# EAGLE design capstone (EAGLE 9.4.0)
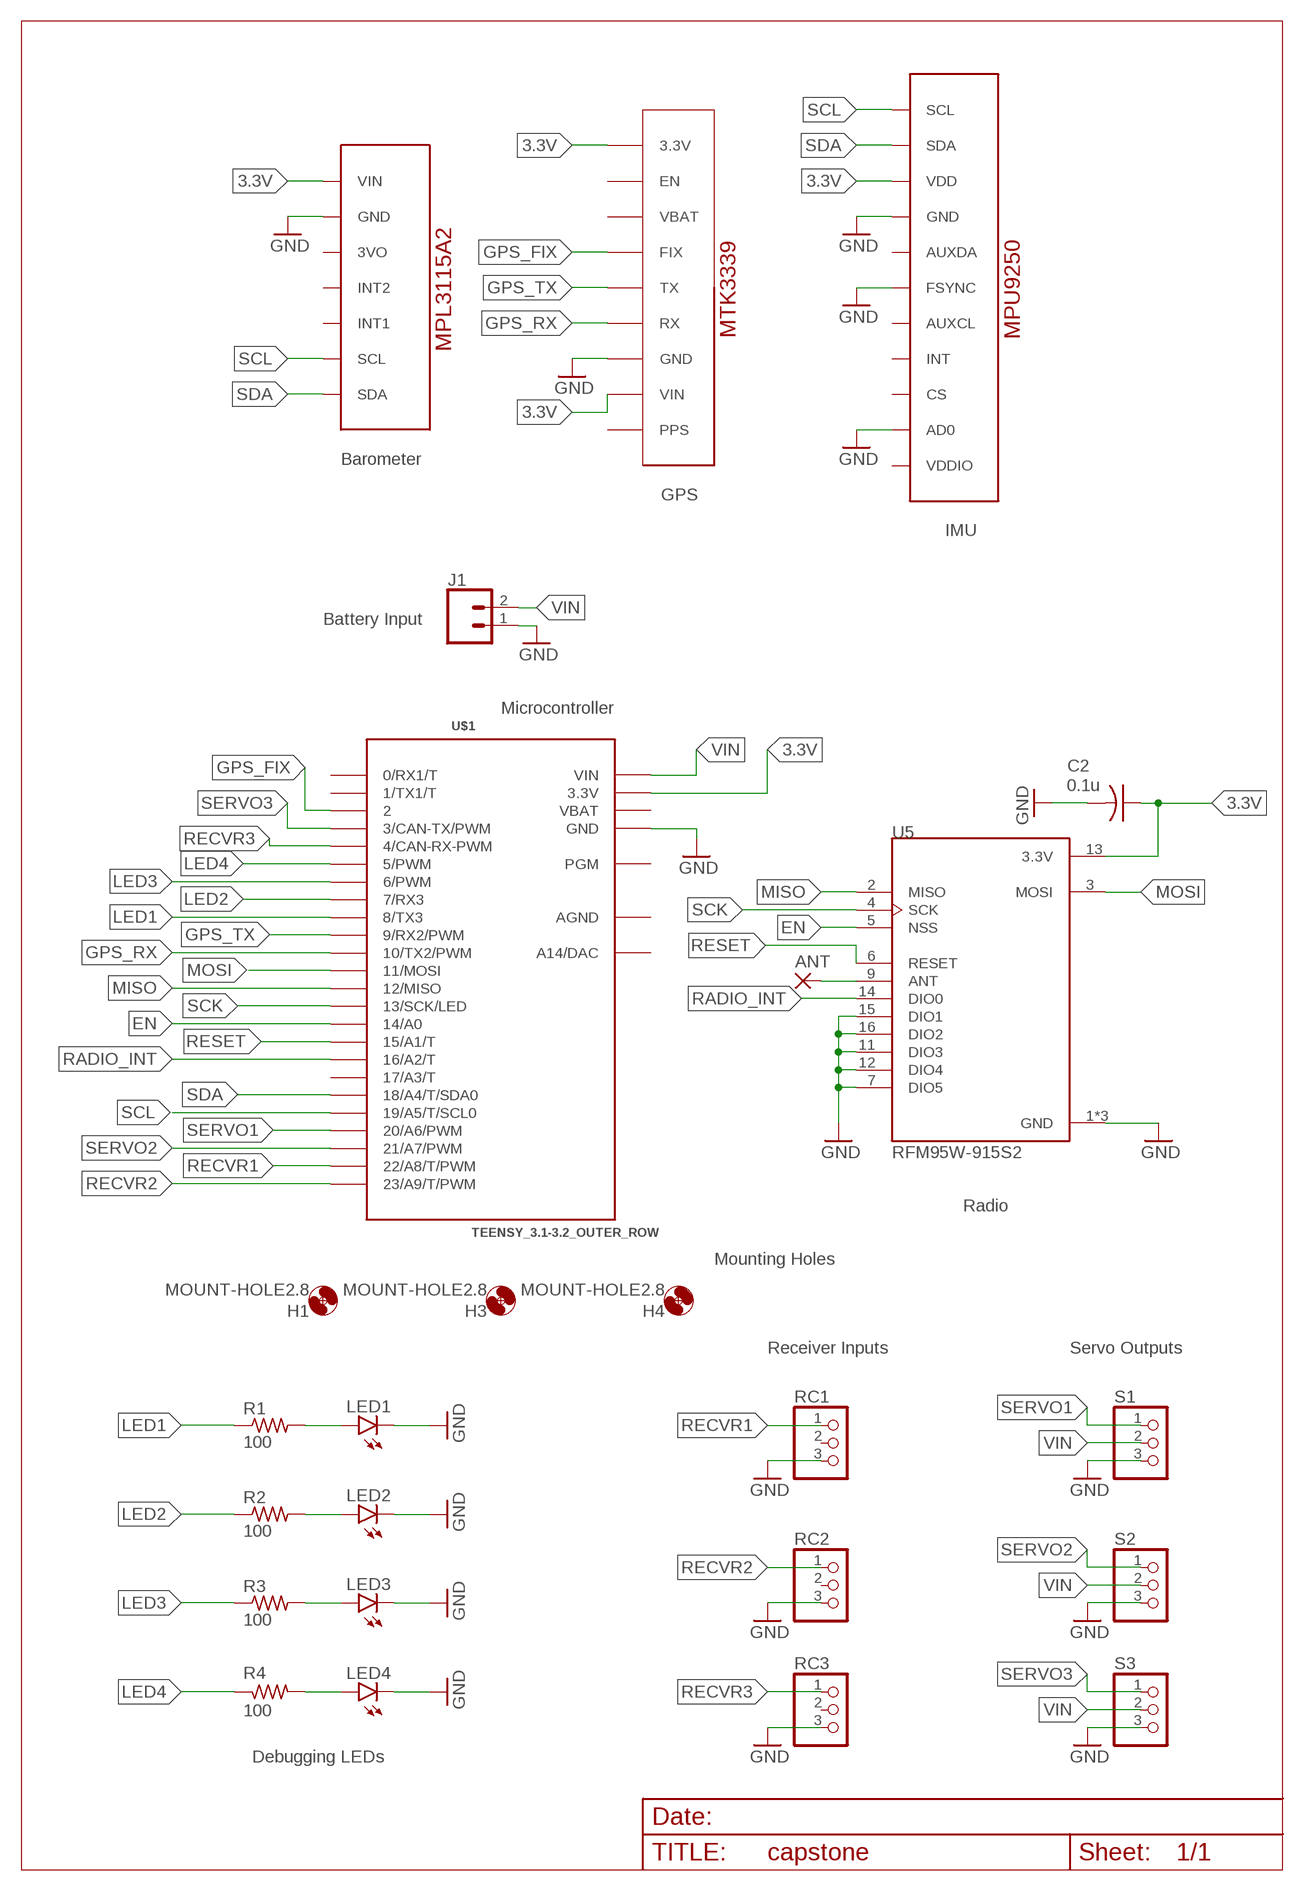
[diagram p0: schematic, sheet 1]

## Parts
ANT  2,54/0,9  [2,54/0,9]
C2  0.1u  C-USC1206  [C1206]
H1  MOUNT-HOLE2.8  [2,8]
H3  MOUNT-HOLE2.8  [2,8]
H4  MOUNT-HOLE2.8  [2,8]
J1  CONN_025MM  [SCREWTERMINAL-5MM-2]
LED1  LEDCHIPLED_1206  [CHIPLED_1206]
LED2  LEDCHIPLED_1206  [CHIPLED_1206]
LED3  LEDCHIPLED_1206  [CHIPLED_1206]
LED4  LEDCHIPLED_1206  [CHIPLED_1206]
R1  100  R-US_M1206  [M1206]
R2  100  R-US_M1206  [M1206]
R3  100  R-US_M1206  [M1206]
R4  100  R-US_M1206  [M1206]
RC1  PINHD-1X3  [1X03]
RC2  PINHD-1X3  [1X03]
RC3  PINHD-1X3  [1X03]
S1  PINHD-1X3  [1X03]
S2  PINHD-1X3  [1X03]
S3  PINHD-1X3  [1X03]
U1  ADAFRUIT_MPL3115A2_BAROMETER  [ADAFRUIT_MPL3115A2_BAROMETER]
U2  ADAFRUIT_MTK3339_GPS  [ADAFRUIT_MTK3339_GPS]
U4  SPARKFUN_MPU9250_IMU  [SPARKFUN_MPU9250_IMU]
U5  RFM95W-915S2  [XCVR_RFM95W-915S2]
U$1  TEENSY_3.1-3.2_OUTER_ROW  [TEENSY_3.0-3.2&LC_OUTER_ROW]

## Nets
3.3V: C2.1 U1.VIN U2.3.3V U2.VIN U4.VDD U5.13(3.3V) U$1.3.3V U$1.3.3V1(3.3V)
EN: U5.5(NSS) U$1.14/A0
GND: C2.2 J1.1 LED1.C LED2.C LED3.C LED4.C RC1.3 RC2.3 RC3.3 S1.3 S2.3 S3.3 U1.GND U2.GND U4.AD0 U4.FSYNC U4.GND U5.1(GND) U5.7(DIO5) U5.8(GND) U5.10(GND) U5.11(DIO3) U5.12(DIO4) U5.15(DIO1) U5.16(DIO2) U$1.GND U$1.GND1(GND)
GPS_FIX: U2.FIX U$1.2
GPS_RX: U2.RX U$1.10(10/TX2/PWM)
GPS_TX: U2.TX U$1.9(9/RX2/PWM)
LED1: R1.1 U$1.8(8/TX3)
LED2: R2.1 U$1.7(7/RX3)
LED3: R3.1 U$1.6(6/PWM)
LED4: R4.1 U$1.5(5/PWM)
MISO: U5.2(MISO) U$1.12(12/MISO)
MOSI: U5.3(MOSI) U$1.11(11/MOSI)
N$1: ANT.1(P) U5.9(ANT)
N$8: LED1.A R1.2
N$9: LED2.A R2.2
N$10: LED3.A R3.2
N$11: LED4.A R4.2
RADIO_INT: U5.14(DIO0) U$1.16/A2(16/A2/T)
RECVR1: RC1.1 U$1.22/A8(22/A8/T/PWM)
RECVR2: RC2.1 U$1.23/A9(23/A9/T/PWM)
RECVR3: RC3.1 U$1.4(4/CAN-RX-PWM)
RESET: U5.6(RESET) U$1.15/A1(15/A1/T)
SCK: U5.4(SCK) U$1.13(13/SCK/LED)
SCL: U1.SCL U4.SCL U$1.19/A5(19/A5/T/SCL0)
SDA: U1.SDA U4.SDA U$1.18/A4(18/A4/T/SDA0)
SERVO1: S1.1 U$1.20/A6(20/A6/PWM)
SERVO2: S2.1 U$1.21/A7(21/A7/PWM)
SERVO3: S3.1 U$1.3(3/CAN-TX/PWM)
VIN: J1.2 S1.2 S2.2 S3.2 U$1.VIN
Unconnected: RC1.2 RC2.2 RC3.2 U1.3VO U1.INT1 U1.INT2 U2.EN U2.PPS U2.VBAT U4.AUXCL U4.AUXDA U4.CS U4.INT U4.VDDIO U$1.0(0/RX1/T) U$1.1(1/TX1/T) U$1.17/A3(17/A3/T) U$1.PGM U$1.RESET/DAC(A14/DAC)

## Notes on the sheet
- Barometer
- GPS
- IMU
- Battery Input
- Microcontroller
- Radio
- Mounting Holes
- Receiver Inputs | Servo Outputs
- Debugging LEDs

## Power pins joined to a net without a drawn wire
AGND: U$1.AGND
VBAT: U$1.VBAT

## Library data of the parts
ANT = wirepad:2,54/0,9: THROUGH-HOLE PAD
C2 = rcl:C-US: CAPACITOR, American symbol; SPICEPREFIX: C
H1 H3 H4 = holes:MOUNT-HOLE: MOUNTING HOLE with drill center marker
J1 = SparkFun-Connectors:CONN_02: Multi connection point. Often used as Generic Header-pin footprint for 0.1 inch spaced/style header connections On any of the 0.1 inch spaced packages, you can populate with these: Break Away Headers - Straight <https://www.sparkfun.com/products/116> (PRT-00116) Break Away Male Headers - Right Angle <https://www.sparkfun.com/products/553> (PRT-00553) Female Headers <https://www.sparkfun.com/products/115> (PRT-00115) Break Away Headers - Machine Pin <https://www.sparkfun.com/products/117> (PRT-00117) Break Away Female Headers - Swiss Machine Pin <https://www.sparkfun.com/products/743> (PRT-00743) For SCREWTERMINALS and SPRING TERMINALS visit here: Screw Terimnals on SparkFun.com <https://www.sparkfun.com/search/results?term=Screw+Terminals> (5mm/3.5mm/2.54mm spacing) This device is also useful as a general connection point to wire up your design to another part of your project. Our various solder wires solder well into these plated through hole pads. Hook-Up Wire - Assortment (Stranded, 22 AWG) <https://www.sparkfun.com/products/11375> (PRT-11375) Hook-Up Wire - Assortment (Solid Core, 22 AWG) <https://www.sparkfun.com/products/11367> (PRT-11367) View the entire wire category on our website here <https://www.sparkfun.com/categories/141> Special notes: Molex polarized connector foot print use with: PRT-08233 with associated crimp pins and housings. 2.54_SCREWTERM for use with PRT-10571. 3.5mm Screw Terminal footprints for PRT-08084 5mm Screw Terminal footprints for use with PRT-08432; SF_SKU: PRT-08432
LED1-LED4 = led:LED: LED OSRAM: - CHIPLED LG R971, LG N971, LY N971, LG Q971, LY Q971, LO R971, LY R971 LH N974, LH R974 LS Q976, LO Q976, LY Q976 LO Q996 - Hyper CHIPLED LW Q18S LB Q993, LB Q99A, LB R99A - SideLED LS A670, LO A670, LY A670, LG A670, LP A670 LB A673, LV A673, LT A673, LW A673 LH A674 LY A675 LS A676, LA A676, LO A676, LY A676, LW A676 LS A679, LY A679, LG A679 - Hyper Micro SIDELED® LS Y876, LA Y876, LO Y876, LY Y876 LT Y87S - SmartLED LW L88C, LW L88S LB L89C, LB L89S, LG L890 LS L89K, LO L89K, LY L89K LS L896, LA L896, LO L896, LY L896 - TOPLED LS T670, LO T670, LY T670, LG T670, LP T670 LSG T670, LSP T670, LSY T670, LOP T670, LYG T670 LG T671, LOG T671, LSG T671 LB T673, LV T673, LT T673, LW T673 LH T674 LS T676, LA T676, LO T676, LY T676, LB T676, LH T676, LSB T676, LW T676 LB T67C, LV T67C, LT T67C, LS T67K, LO T67K, LY T67K, LW E67C LS E67B, LA E67B, LO E67B, LY E67B, LB E67C, LV E67C, LT E67C LW T67C LS T679, LY T679, LG T679 LS T770, LO T770, LY T770, LG T770, LP T770 LB T773, LV T773, LT T773, LW T773 LH T774 LS E675, LA E675, LY E675, LS T675 LS T776, LA T776, LO T776, LY T776, LB T776 LHGB T686 LT T68C, LB T68C - Hyper Mini TOPLED® LB M676 - Mini TOPLED Santana® LG M470 LS M47K, LO M47K, LY M47K Source: http://www.osram.convergy.de LUXEON: - LUMILED® LXK2-PW12-R00, LXK2-PW12-S00, LXK2-PW14-U00, LXK2-PW14-V00 LXK2-PM12-R00, LXK2-PM12-S00, LXK2-PM14-U00 LXK2-PE12-Q00, LXK2-PE12-R00, LXK2-PE12-S00, LXK2-PE14-T00, LXK2-PE14-U00 LXK2-PB12-K00, LXK2-PB12-L00, LXK2-PB12-M00, LXK2-PB14-N00, LXK2-PB14-P00, LXK2-PB14-Q00 LXK2-PR12-L00, LXK2-PR12-M00, LXK2-PR14-Q00, LXK2-PR14-R00 LXK2-PD12-Q00, LXK2-PD12-R00, LXK2-PD12-S00 LXK2-PH12-R00, LXK2-PH12-S00 LXK2-PL12-P00, LXK2-PL12-Q00, LXK2-PL12-R00 Source: www.luxeon.com KINGBRIGHT: KA-3528ASYC Source: www.kingbright.com
R1-R4 = rcl:R-US_: RESISTOR, American symbol; SPICEPREFIX: R
RC1-RC3 S1-S3 = pinhead:PINHD-1X3: PIN HEADER
U1 = AERO_Eagle_Library:ADAFRUIT_MPL3115A2_BAROMETER: Adafruit's Barometer and Environment Sensing: MPL3115A2 https://www.adafruit.com/product/1893
U2 = AERO_Eagle_Library:ADAFRUIT_MTK3339_GPS: Adafruit's Ultimate GPS Breakout: MTK3339 https://www.adafruit.com/product/746
U4 = AERO_Eagle_Library:SPARKFUN_MPU9250_IMU: Sparkfun's 9-DOF IMU: MPU9250 https://www.sparkfun.com/products/13762
U5 = RFM95W-915S2:RFM95W-915S2: RFM95(W) - Low Power Long Range Transceiver Module V1.0; DESCRIPTION: RFM95W LoRA Transceiver Module 915MHz; DIGI-KEY_PART_NUMBER: RFM95W-915S2-ND; DIGI-KEY_PURCHASE_URL: https://www.digikey.ca/product-detail/en/rf-solutions/RFM95W-915S2/RFM95W-915S2-ND/6564923?utm_source=snapeda&utm_medium=aggregator&utm_campaign=symbol; MF: RF Solutions; MP: RFM95W-915S2; PACKAGE: SMD-16 RF Solutions
U$1 = Teensy_3_and_LC_Series_Boards_v1.4:TEENSY_3.1-3.2_OUTER_ROW: Footprint for Teensy 3.1 or 3.2 board using all pin connections on the outer perimeter

## Board
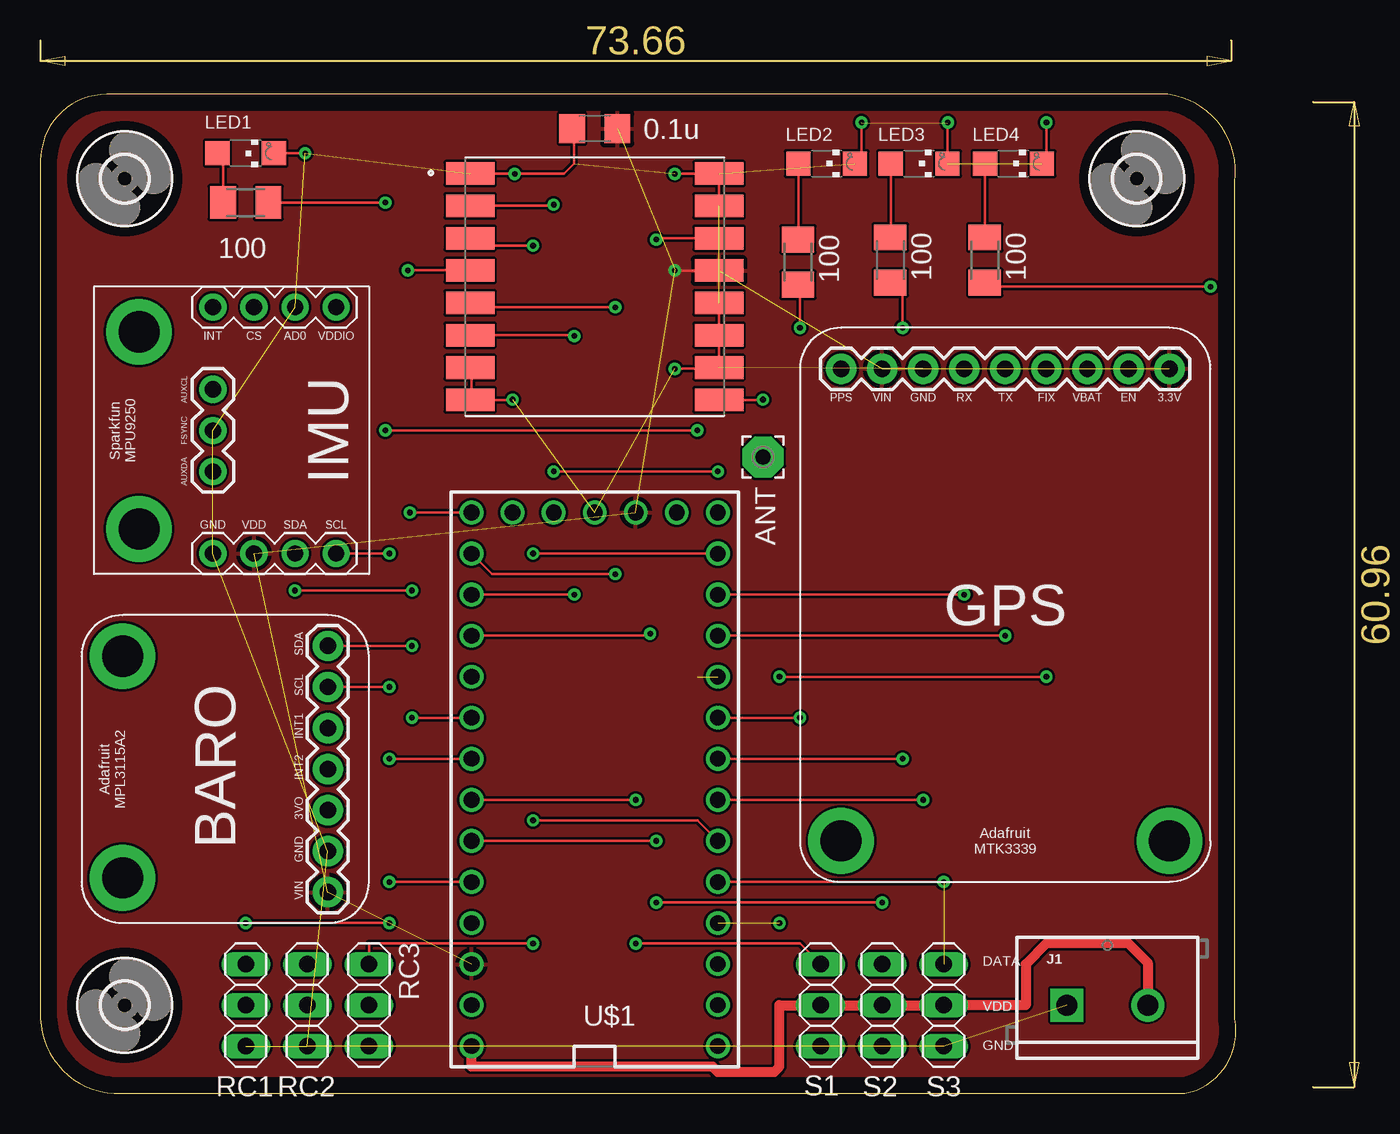
[diagram p1: board, top side]
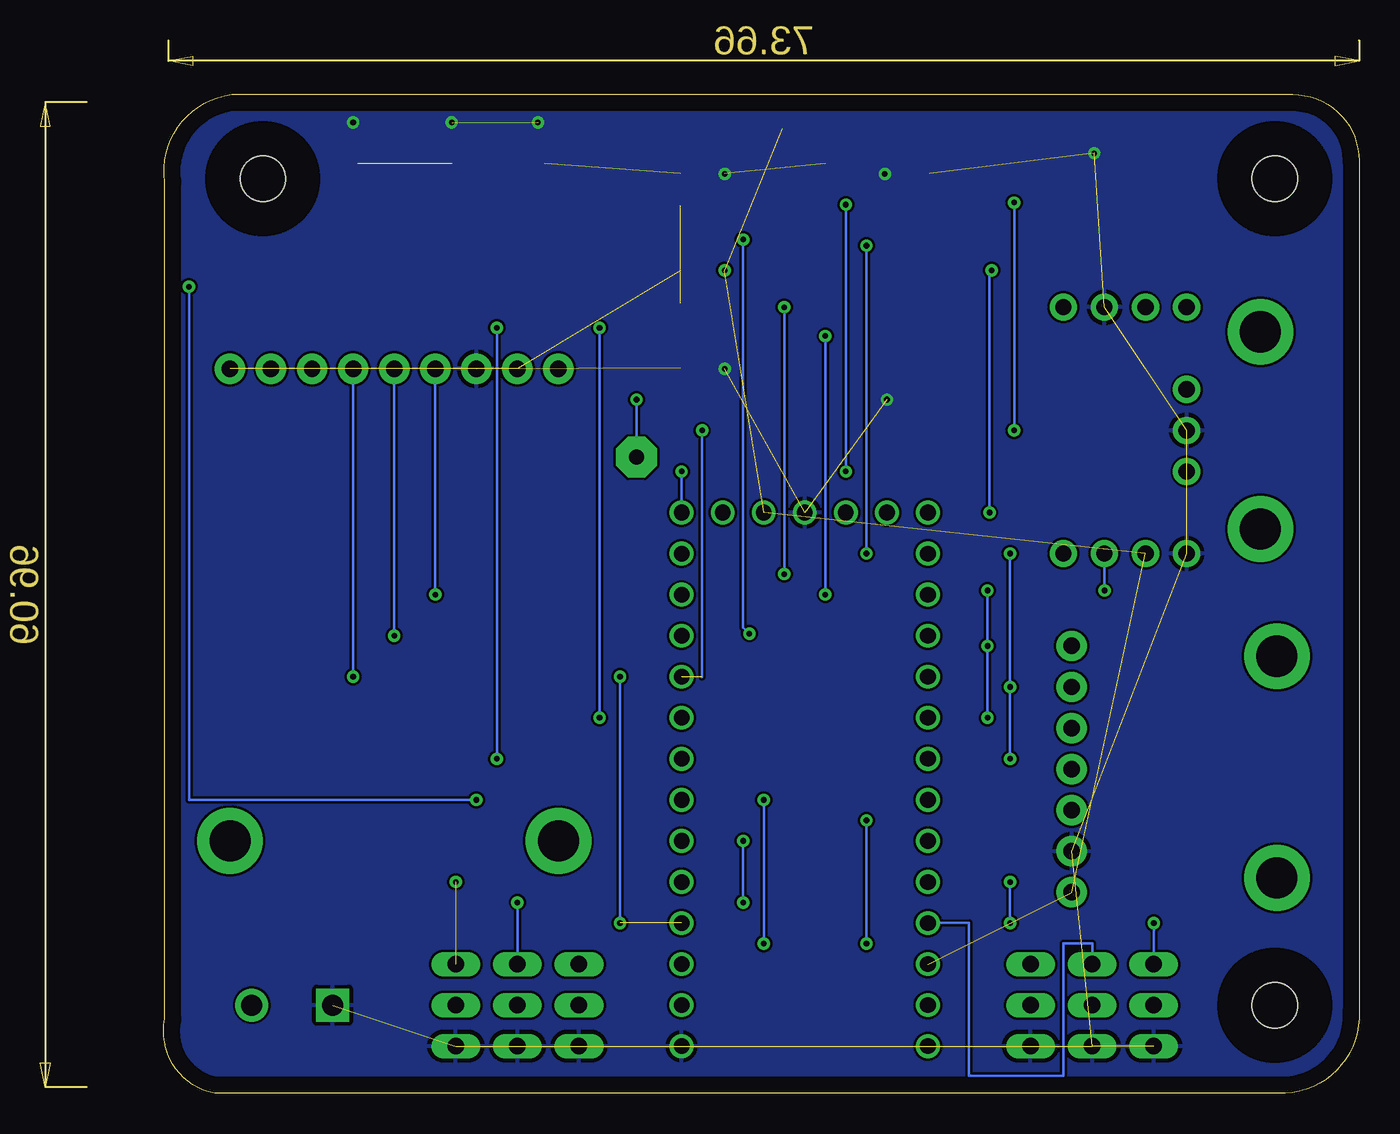
[diagram p2: board, bottom side, seen from below]

Size 73.97 x 61.81 mm. Coordinates in mm from the lower left corner, seen from the top.
Outline: 0,57.71 0,5.07 arc90 4.57,0 70.82,0 arc90 73.89,4.6 73.89,56.41 arc90 69.76,61.81 4.11,61.81 arc90 0,57.71
Copper layers (1*16): Top 0.035mm / dielectric 1.5mm / Bottom 0.035mm
Design rules "default": minimum track width 6mil, minimum drill 0.35mm, track to track 6mil, track to pad 6mil, pad to pad 6mil, via to via 6mil, smd to smd 6mil, copper to edge 40mil, drill to drill 6mil, minimum pad ring 10mil, minimum via ring 8mil, stop-mask expansion 4mil, vias tented up to drill 0mil, thermal gap 10mil

### Footprints (pad centres in the part's own frame; a part is rotated, then mirrored left to right if it is on the bottom)
2,54/0,9 = drill 0.914 pad 2.54 octagon: 1 0,0
C1206 = smd 1.6 x 1.8: 1 -1.4,0; 2 1.4,0
2,8 = hole 2.8: 0,0
SCREWTERMINAL-5MM-2 = drill 1.3 pad 2.032 square: 1 0,0 | drill 1.3 pad 2.032: 2 5,0
CHIPLED_1206 = smd 1.5 x 1.5: A 0,-1.75; C 0,1.75
M1206 = smd 1.6 x 2: 1 -1.4,0; 2 1.4,0
1X03 = drill 1.016 long: 1 -2.54,0; 2 0,0; 3 2.54,0
ADAFRUIT_MPL3115A2_BAROMETER = drill 1.016 pad 1.88: 3VO 6.985,2.54; GND 4.445,2.54; INT1 12.065,2.54; INT2 9.525,2.54; SCL 14.605,2.54; SDA 17.145,2.54; VIN 1.905,2.54 | drill 2.54 pad 4.064: P$1 16.51,15.24; P$2 2.794,15.24
ADAFRUIT_MTK3339_GPS = drill 1.016 pad 1.88: 3.3V 2.54,2.54; EN 5.08,2.54; FIX 10.16,2.54; GND 17.78,2.54; PPS 22.86,2.54; RX 15.24,2.54; TX 12.7,2.54; VBAT 7.62,2.54; VIN 20.32,2.54 | drill 2.54 pad 4.064: P$1 22.86,31.75; P$2 2.54,31.75
SPARKFUN_MPU9250_IMU = drill 1.001 pad 1.676: AD0 4.572,1.27; AUXCL 9.652,6.35; AUXDA 9.652,11.43; CS 7.112,1.27; FSYNC 9.652,8.89; GND 9.652,16.51; SCL 2.032,16.51; SDA 4.572,16.51; VDD 7.112,16.51; VDDIO 2.032,1.27 | drill 1 pad 1.676: INT 9.652,1.27 | drill 2.54 pad 4.064: P$1 14.224,2.794; P$2 14.224,14.986
XCVR_RFM95W-915S2 = smd 3 x 1.4: 1 -7.7,7; 2 -7.7,5; 3 -7.7,3; 4 -7.7,1; 5 -7.7,-1; 6 -7.7,-3; 7 -7.7,-5; 8 -7.7,-7; 9 7.7,-7; 10 7.7,-5; 11 7.7,-3; 12 7.7,-1; 13 7.7,1; 14 7.7,3; 15 7.7,5; 16 7.7,7
TEENSY_3.0-3.2&LC_OUTER_ROW = drill 0.965: 0 -7.62,13.97; 1 -7.62,11.43; 2 -7.62,8.89; 3 -7.62,6.35; 3.3V 7.62,11.43; 3.3V1 -2.54,-16.51; 4 -7.62,3.81; 5 -7.62,1.27; 6 -7.62,-1.27; 7 -7.62,-3.81; 8 -7.62,-6.35; 9 -7.62,-8.89; 10 -7.62,-11.43; 11 -7.62,-13.97; 12 -7.62,-16.51; 13 7.62,-16.51; 14/A0 7.62,-13.97; 15/A1 7.62,-11.43; 16/A2 7.62,-8.89; 17/A3 7.62,-6.35; 18/A4 7.62,-3.81; 19/A5 7.62,-1.27; 20/A6 7.62,1.27; 21/A7 7.62,3.81; 22/A8 7.62,6.35; 23/A9 7.62,8.89; AGND 7.62,13.97; GND -7.62,16.51; GND1 0,-16.51; PGM 2.54,-16.51; RESET/DAC 5.08,-16.51; VBAT -5.08,-16.51; VIN 7.62,16.51

### Placement (x,y rotation side)
ANT  44.71,39.37 0 top
C2  34.29,59.69 180 top
H1  5.21,56.59 0 top
H3  67.82,56.59 0 top
H4  5.21,5.46 0 top
J1  63.5,5.46 0 top
LED1  12.7,58.17 270 top
LED2  48.64,57.53 270 top
LED3  54.36,57.53 270 top
LED4  60.2,57.53 270 top
R1  12.7,55.12 180 top
R2  46.87,51.44 90 top
R3  52.58,51.56 90 top
R4  58.42,51.56 90 top
RC1  12.7,5.46 270 top
RC2  16.51,5.46 270 top
RC3  20.32,5.46 270 top
S1  48.26,5.46 270 top
S2  52.07,5.46 270 top
S3  55.88,5.46 270 top
U1  20.32,10.54 90 top
U2  72.39,47.37 180 top
U4  20.32,49.91 180 top
U5  34.29,49.91 0 top
U$1  34.29,19.43 180 top

### Tracks (layer width: path | path; a pad name or v marks a point on that pad's centre or on a via)
3.3V  (via drill 0.35)  (7 unrouted)
  Top 0.152: U5.13 39.26,50.91 v39.25,50.93
  pour Top: 0,-3.43 73.66,-3.43 73.66,61.34 0,61.34
EN  (via drill 0.35)
  Top 0.152: U5.5 26.86,48.64 v35.56,48.64 | U$1.14/A0 27.94,32.13 v35.56,32.13
  Bottom 0.152: v35.56,48.64 v35.56,32.13
GND  (via drill 0.35)  (21 unrouted)
  Top 0.152: U5.1 29.32,56.91 v29.34,56.9 32.39,56.9 33.02,57.53 33.02,59.56 C2.2 | U5.8 26.67,42.91 | 26.67,42.91 29.2,42.91 v29.21,42.93 | v39.25,44.83 41.91,44.83 U5.10 U5.11 U5.12 | LED1.C v16.39,58.17 | LED2.C 50.8,57.94 v50.8,60.07 | LED3.C 56.11,60.04 v56.14,60.07 | LED4.C 62.23,57.81 v62.23,60.07 | v39.25,56.9 39.26,56.91 U5.16 U5.15 | U5.7 26.67,44.83 26.67,42.91
  pour Bottom: -1.27,-0.89 -1.27,62.61 74.93,62.61 74.93,-0.89
GPS_FIX  (via drill 0.35)  (1 unrouted)
  Top 0.152: v62.23,25.78 v45.72,25.78
  Bottom 0.152: U2.FIX v62.23,25.78 | v45.72,25.78 v45.72,10.54
GPS_RX  (via drill 0.35)
  Top 0.152: U$1.10 v57.15,30.86
  Bottom 0.152: v57.15,30.86 U2.RX
GPS_TX  (via drill 0.35)
  Top 0.152: U$1.9 v59.69,28.32
  Bottom 0.152: v59.69,28.32 U2.TX
LED1  (via drill 0.35)  (1 unrouted)
  Top 0.152: R1.1 v21.34,55.12 | v21.34,41.02 v40.64,41.02
  Bottom 0.152: v21.34,55.12 v21.34,41.02 | v40.64,41.02 40.64,25.78
LED2  (via drill 0.35)
  Top 0.152: U$1.7 v46.99,23.24 | v46.99,47.37 46.99,49.91 R2.1
  Bottom 0.152: v46.99,23.24 v46.99,47.37
LED3  (via drill 0.35)
  Top 0.152: R3.1 53.34,49.4 v53.34,47.37 | v53.34,20.7 U$1.6
  Bottom 0.152: v53.34,47.37 v53.34,20.7
LED4  (via drill 0.35)
  Top 0.152: U$1.5 v54.61,18.16 | R4.1 58.67,49.91 v72.39,49.91
  Bottom 0.152: v72.39,49.91 72.39,18.16 v54.61,18.16
MISO  (via drill 0.35)
  Top 0.152: v41.91,38.48 v31.75,38.48 | v31.75,54.99 31.67,54.91 U5.2
  Bottom 0.152: U$1.12 v41.91,38.48 | v31.75,38.48 v31.75,54.99
MOSI  (via drill 0.35)
  Top 0.152: U$1.11 v30.48,33.4 | v30.48,52.45 27.05,52.45 U5.3
  Bottom 0.152: v30.48,33.4 v30.48,52.45
N$1  (via drill 0.35)
  Top 0.152: U5.9 44.69,42.91 v44.71,42.93
  Bottom 0.152: v44.71,42.93 ANT.1
N$8
  Top 0.152: R1.2 11.3,57.82 LED1.A
N$9
  Top 0.152: LED2.A 46.89,52.86 R2.2
N$10
  Top 0.152: LED3.A 52.61,52.99 R3.2
N$11
  Top 0.152: LED4.A 58.42,57.5 R4.2
RADIO_INT  (via drill 0.35)
  Top 0.152: U$1.16/A2 37.72,28.32 v37.72,28.45 | U5.14 38.18,52.91 v38.1,52.83
  Bottom 0.152: v37.72,28.45 38.1,28.83 v38.1,52.83
RECVR1  (via drill 0.35)
  Top 0.152: U$1.22/A8 v21.59,13.08 | v21.59,10.54 v12.7,10.54
  Bottom 0.152: RC1.1 v12.7,10.54 | v21.59,13.08 v21.59,10.54
RECVR2
  Bottom 0.152: RC2.1 16.51,9.27 18.29,9.27 18.29,1.09 24.13,1.09 24.13,10.54 U$1.23/A9
RECVR3  (via drill 0.35)
  Top 0.152: U$1.4 40.64,16.89 v30.48,16.89 | v30.48,9.27 20.32,9.27 RC3.1
  Bottom 0.152: v30.48,16.89 v30.48,9.27
RESET  (via drill 0.35)
  Top 0.152: U5.6 32.97,46.91 v33.02,46.86 | v33.02,30.86 U$1.15/A1
  Bottom 0.152: v33.02,46.86 v33.02,30.86
SCK  (via drill 0.35)
  Top 0.152: U$1.13 v22.86,35.94 | v22.74,50.93 26.58,50.93 U5.4
  Bottom 0.152: v22.86,35.94 22.86,50.93 v22.74,50.93
SCL  (via drill 0.35)
  Top 0.152: U1.SCL v21.59,25.15 | v21.59,20.7 U$1.19/A5 | U4.SCL v21.59,33.4
  Bottom 0.152: v21.59,20.7 v21.59,25.15 v21.59,33.4
SDA  (via drill 0.35)
  Top 0.152: U1.SDA v22.99,27.69 | v22.99,23.24 U$1.18/A4 | v15.75,31.12 v22.99,31.12
  Bottom 0.152: v22.99,23.24 v22.99,27.69 v22.99,31.12 | U4.SDA v15.75,31.12
SERVO1  (via drill 0.35)
  Top 0.152: S1.1 46.99,9.27 v36.83,9.27 | v36.83,18.16 U$1.20/A6
  Bottom 0.152: v36.83,18.16 v36.83,9.27
SERVO2  (via drill 0.35)
  Top 0.152: v52.07,11.81 v38.1,11.81 | U$1.21/A7 v38.1,15.62
  Bottom 0.152: v52.07,11.81 S2.1 | v38.1,15.62 v38.1,11.81
SERVO3  (via drill 0.35)  (1 unrouted)
  Top 0.152: U$1.3 v55.88,13.08
VIN
  Top 0.61: U$1.VIN 26.67,1.65 41.58,1.65 41.91,1.32 45.39,1.32 45.72,1.65 45.72,5.46 S1.2 S2.2 S3.2 60.96,5.46 60.96,8 62.23,9.27 67.31,9.27 68.5,8.08 J1.2

### Text on the board
tNames: DATA | VDD | GND